# EAGLE design magnet (EAGLE 9.6.2)

## Sheet 1 of 2
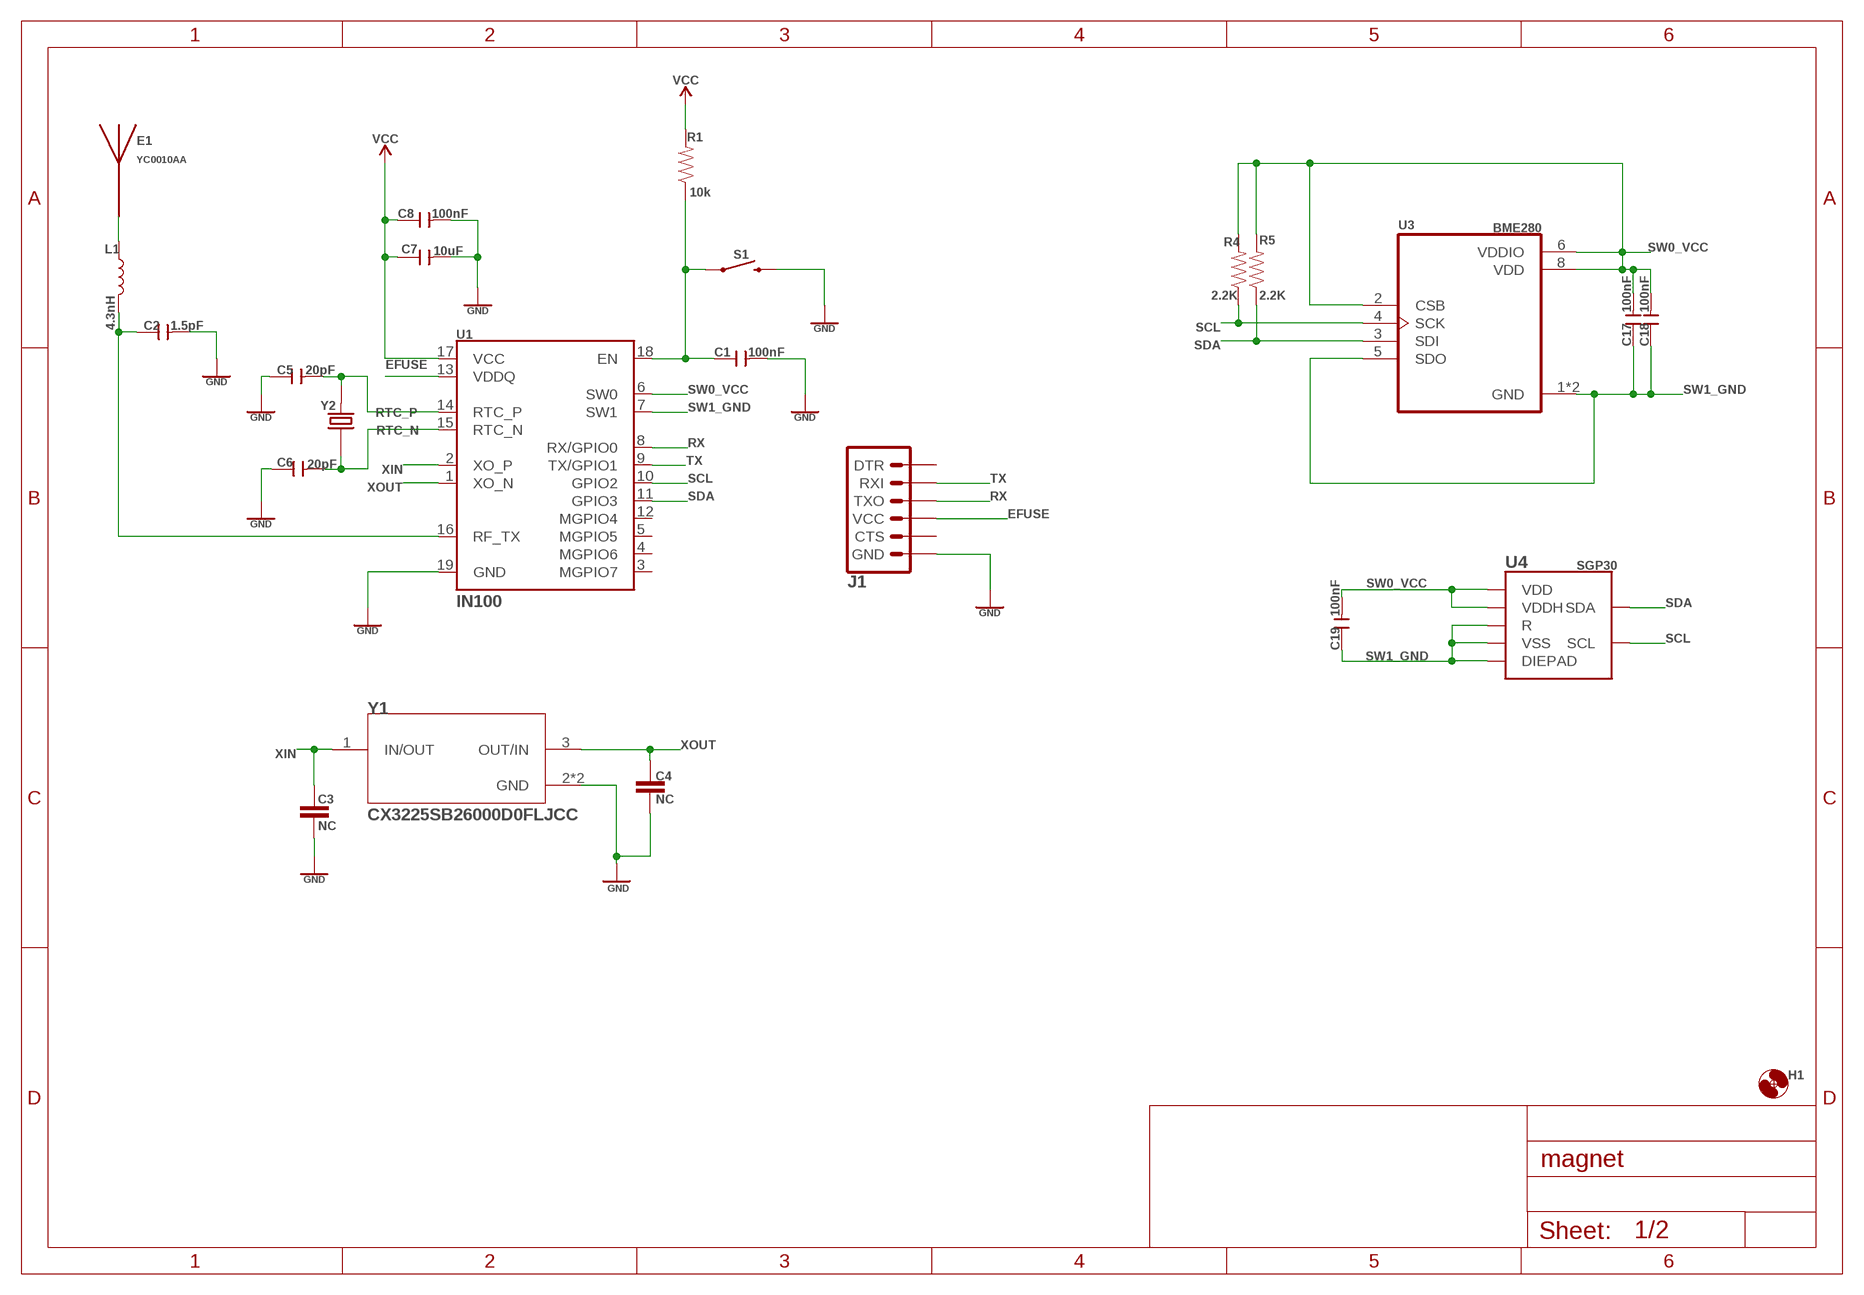
[diagram p0: schematic, sheet 1]

### Parts
C1  100nF  CERAMIC-100NF-50V-10%-X7R(0603)  [C0603]
C2  1.5pF  CERAMIC-10PF-50V-5%-NPO(0603)  [C0603]
C3  NC  12PF-0603-50V-5%  [0603]
C4  NC  12PF-0603-50V-5%  [0603]
C5  20pF  CERAMIC-22PF-50V-5%-NPO(0603)  [C0603]
C6  20pF  CERAMIC-22PF-50V-5%-NPO(0603)  [C0603]
C7  10uF  CERAMIC-10UF-10V-10%-X5R(0603)  [C0603]
C8  100nF  CERAMIC-100NF-50V-10%-X7R(0603)  [C0603]
C17  100nF  CERAMIC-100NF-50V-10%-X7R(0603)  [C0603]
C18  100nF  CERAMIC-100NF-50V-10%-X7R(0603)  [C0603]
C19  100nF  CERAMIC-100NF-50V-10%-X7R(0603)  [C0603]
E1  YC0010AA  [XCVR_YC0010AA]
H1  MOUNT-HOLE3.0  [3,0]
J1  6_PIN_SERIAL_TARGETSMD  [1X06-SMD_RA_MALE]
L1  4.3nH  INDUCTOR-0603-33NH  [0603]
R1  10k  10KOHM-0603-1/10W-1%  [0603]
R4  2.2K  2.2KOHM-0603-1/10W-1%  [0603]
R5  2.2K  2.2KOHM-0603-1/10W-1%  [0603]
S1  MOMENTARY-SWITCH-SPST-SMD-4.6X2.8MM  [TACTILE_SWITCH_SMD_4.6X2.8MM]
U1  IN100  [IN100]
U3  BME280  [PSON65P250X250X100-8N]
U4  SGP30  [SGP30]
Y1  CX3225SB26000D0FLJCC  ECS-480-8-33B-CWY-TR3  [XTAL_ECS-480-8-33B-CWY-TR3]
Y2  ECS-.327-12.5-16-TR  [XTAL_ECS-.327-12.5-16-TR]

### Nets
EFUSE: J1.4(VCC) U1.13(VDDQ)
GND: C1.2 C2.2 C3.2 C4.2 C5.1 C6.1 C7.2 C8.2 J1.6(GND) S1.3 S1.4 U1.19(GND) Y1.2(GND) Y1.4(GND) ; also sheet 2
N$1: C2.1 L1.2 U1.16(RF_TX)
N$2: E1.1 L1.1
N$3: C1.1 R1.1 S1.1 S1.2 U1.18(EN)
RTC_N: C6.2 U1.15(RTC_N) Y2.1
RTC_P: C5.2 U1.14(RTC_P) Y2.2
RX: J1.3(TXO) U1.8(RX/GPIO0)
SCL: R4.1 U1.10(GPIO2) U3.4(SCK) U4.6(SCL)
SDA: R5.1 U1.11(GPIO3) U3.3(SDI) U4.3(SDA)
SW0_VCC: C17.2 C18.2 C19.2 R4.2 R5.2 U1.6(SW0) U3.2(CSB) U3.6(VDDIO) U3.8(VDD) U4.1(VDD) U4.5(VDDH)
SW1_GND: C17.1 C18.1 C19.1 U1.7(SW1) U3.1(GND) U3.5(SDO) U3.7(GND) U4.2(VSS) U4.4(R) U4.DIEPAD
TX: J1.2(RXI) U1.9(TX/GPIO1)
VCC: C7.1 C8.1 R1.2 U1.17(VCC) ; also sheet 2
XIN: C3.1 U1.2(XO_P) Y1.1(IN/OUT)
XOUT: C4.1 U1.1(XO_N) Y1.3(OUT/IN)
Unconnected: J1.1(DTR) J1.5(CTS) U1.3(MGPIO7) U1.4(MGPIO6) U1.5(MGPIO5) U1.12(MGPIO4)

## Sheet 2 of 2
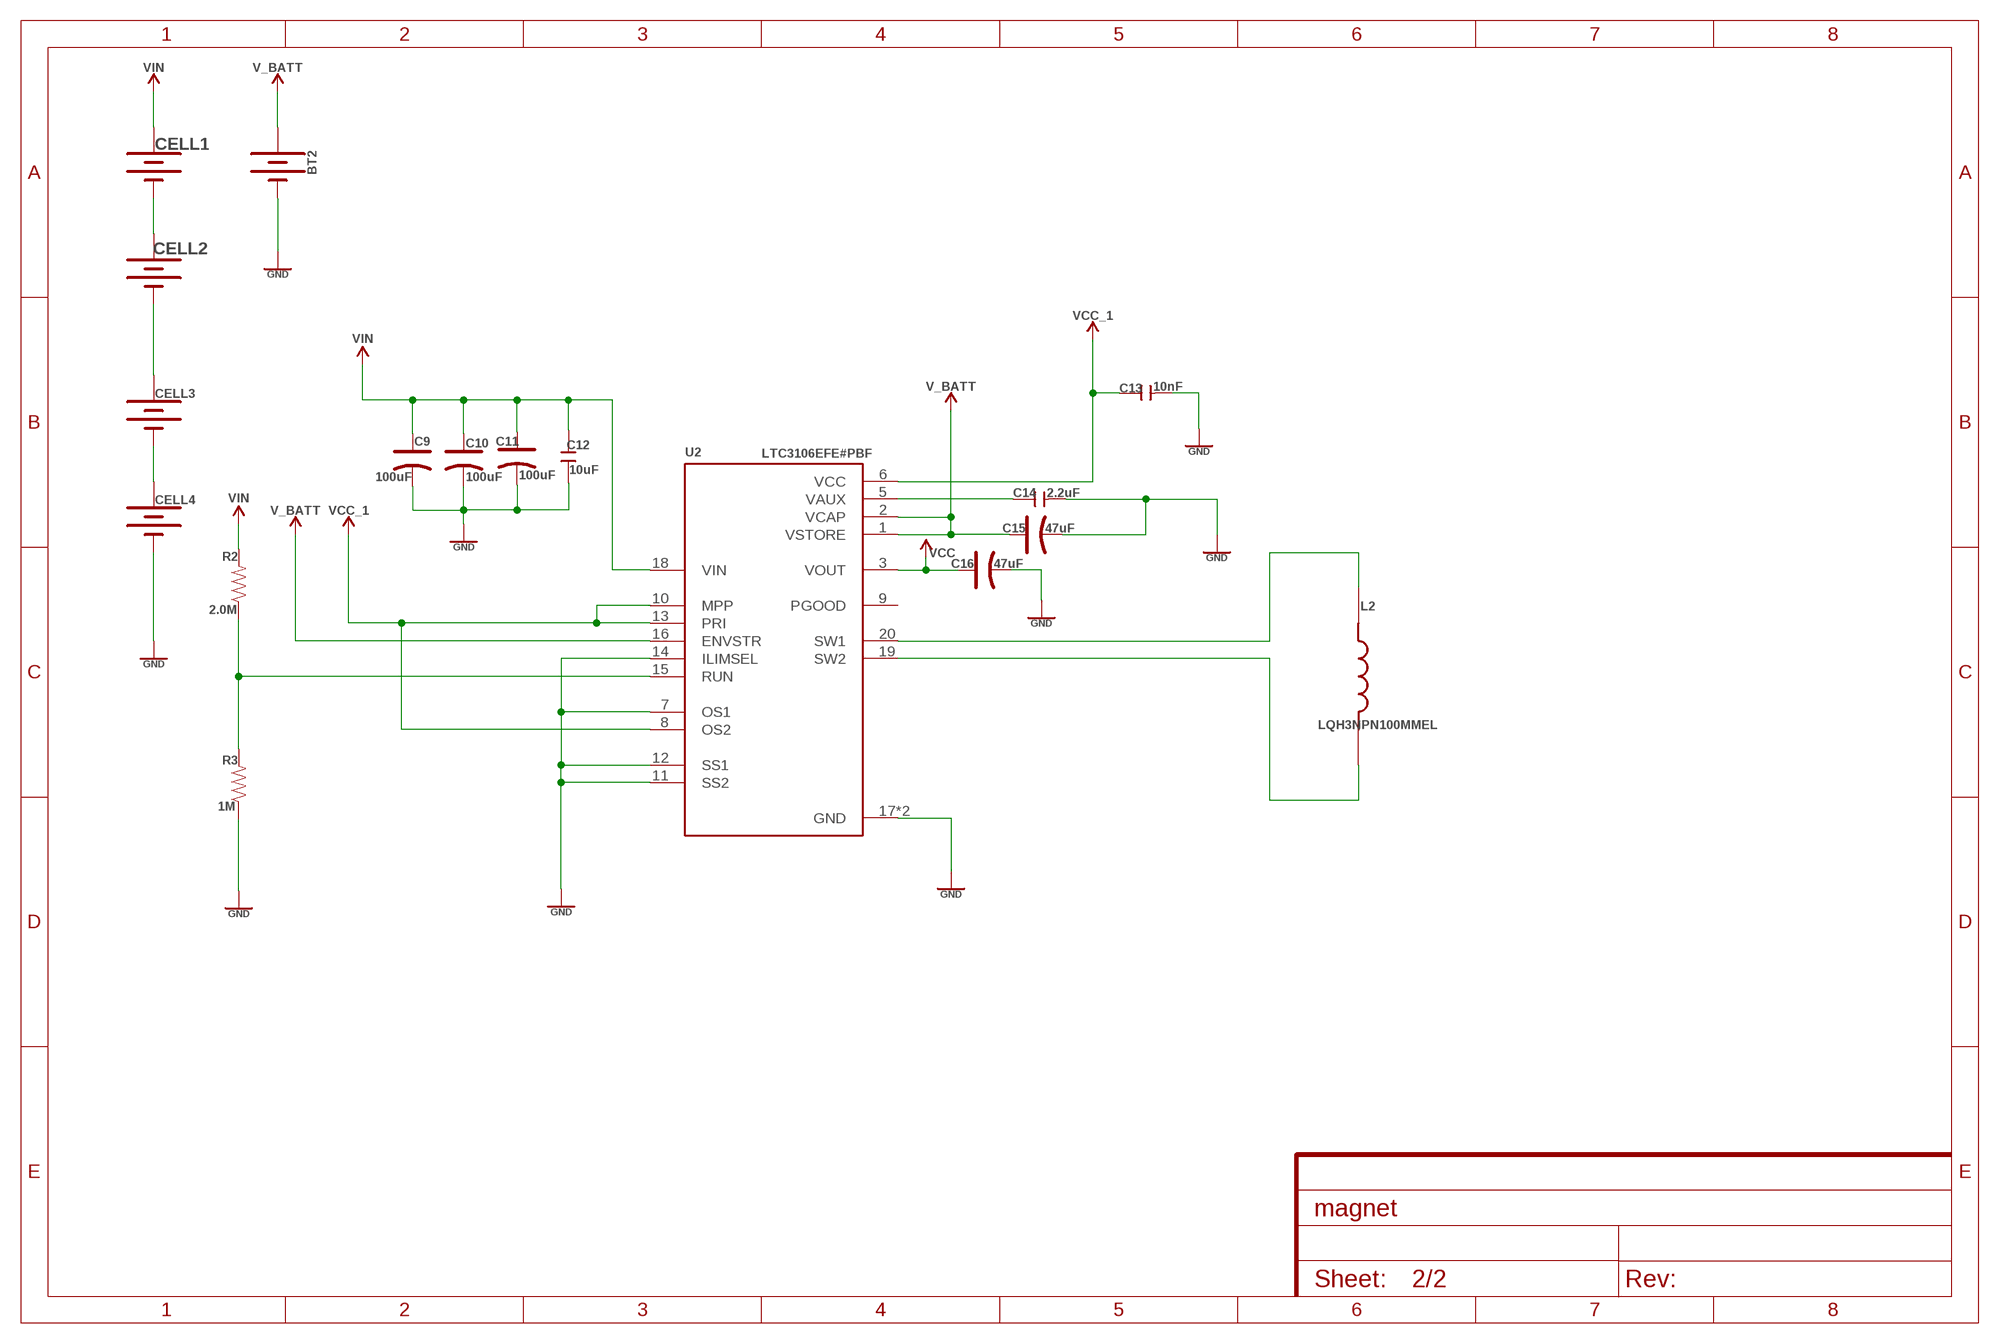
[diagram p1: schematic, sheet 2]

### Parts
BT2  BATTERY-12MM_SMD  [BATTCON_12MM]
C9  100uF  TANTALUM-SMD-47UF-6.3V(AVX-A)  [AVX-A]
C10  100uF  TANTALUM-SMD-47UF-6.3V(AVX-A)  [AVX-A]
C11  100uF  TANTALUM-SMD-47UF-6.3V(AVX-A)  [AVX-A]
C12  10uF  CERAMIC-10UF-6.3V-20%-X5R(0603)  [C0603]
C13  10nF  CERAMIC-10NF-50V-10%-X7R(0603)  [C0603]
C14  2.2uF  CERAMIC-2.2UF-10V-10%-X7R(0603)  [C0603]
C15  47uF  TANTALUM-SMD-47UF-6.3V(AVX-A)  [AVX-A]
C16  47uF  TANTALUM-SMD-47UF-6.3V(AVX-A)  [AVX-A]
CELL1  KXOB25  [KXOB25]
CELL2  KXOB25  [KXOB25]
CELL3  KXOB25  [KXOB25]
CELL4  KXOB25  [KXOB25]
L2  LQH3NPN100MMEL  [IND_LQH3NPN100MMEL]
R2  2.0M  2MOHMS-0603-1/10W-1%  [0603]
R3  1M  1MOHM-0603-1/4W-5%  [0603]
U2  LTC3106EFE#PBF  [SOP65P640X120-21N]

### Nets
GND: BT2.GND(-) C9.- C10.- C11.- C12.1 C13.2 C14.2 C15.- C16.- CELL4.- R3.1 U2.7(OS1) U2.11(SS2) U2.12(SS1) U2.14(ILIMSEL) U2.17(GND) U2.21(GND) ; also sheet 1
N$4: L2.1 U2.20(SW1)
N$5: L2.2 U2.19(SW2)
N$6: CELL1.- CELL2.+
N$7: CELL2.- CELL3.+
N$8: CELL3.- CELL4.+
N$9: C14.1 U2.5(VAUX)
N$10: R2.1 R3.2 U2.15(RUN)
V_BATT: BT2.PWR@1(+) C15.+ U2.1(VSTORE) U2.2(VCAP) U2.16(ENVSTR)
VCC: C16.+ U2.3(VOUT) ; also sheet 1
VCC_1: C13.1 U2.6(VCC) U2.8(OS2) U2.10(MPP) U2.13(PRI)
VIN: C9.+ C10.+ C11.+ C12.2 CELL1.+ R2.2 U2.18(VIN)
Unconnected: U2.9(PGOOD)

## Library data of the parts
BT2 = SparkFun-Batteries:BATTERY: Battery - Single Cell A variety of battery chemistries, sizes, and footprints. Device List: 20MM_PTH - Coin Cell Battery Holder - 20mm (PTH) <https://www.sparkfun.com/products/783> 6.8MM_PTH - Coin Cell Battery Holder - 6.8MM(SMD) <https://www.digikey.com/product-detail/en/seiko-instruments/MS621FE-FL11E/728-1057-ND/1889208?WT.srch=1&gclid=CNOQ5a6LzdQCFZS2wAodXCkE0g> 12MM_SMD - Coin Cell Battery Holder - 12mm (SMD) <https://www.sparkfun.com/products/10592> 12MM_PTH - Coin Cell Battery Holder - 12mm (PTH) <https://www.sparkfun.com/products/7948> 20MM_SMD - 20mm Coin Cell Battery Holder (SMD) (2 legs) Used on the Big Time Watch Kit <https://www.sparkfun.com/products/11734> 20MM_SMD_4LEGS - Coin Cell Battery Holder - 20mm (SMD) <https://www.sparkfun.com/products/11892> 20MM_SMD_4LEGS_OVERPASTE - Coin Cell Battery Holder - 20mm (SMD) <https://www.sparkfun.com/products/11892> (Over-paste on the legs) 24.5MM_PTH - Coin Cell Battery Holder - 24.5mm (PTH) <https://www.sparkfun.com/products/8863> 9V - 9V Battery Holder - PC Mount Used on the SparkFun SparkPunk Sound Kit <https://www.sparkfun.com/products/11177> and SparkFun SparkPunk Sequencer Kit <https://www.sparkfun.com/products/12707> 18650 - Battery Holder - 18650 (PTH) <https://www.sparkfun.com/products/13113> AA - Battery Holder - 1xAA (PTH) <https://www.sparkfun.com/products/7949> AAA - Battery Holder - 1xAAA (PTH) <https://www.sparkfun.com/products/12718> AA_KIT - Battery Holder - 1xAA (PTH) <https://www.sparkfun.com/products/7949> Special kit package - pads only have exposed copper on one side of the board. AAA_KIT - Battery Holder - 1xAAA (PTH) <https://www.sparkfun.com/products/12718> Special kit package - pads only have exposed copper on one side of the board.; PROD_ID: BATT-08044; SF_SKU: PRT-10592
C1 C8 C17-C19 = OPL_Capacitor:CERAMIC-100NF-50V-10%-X7R(0603): 302010138; MPN: CC0603KRX7R9BB104; VALUE: 100nf
C2 = OPL_Capacitor:CERAMIC-10PF-50V-5%-NPO(0603): 302010097; MPN: CC0603JRNPO9BN100; VALUE: 10pf
C3 C4 = SparkFun-Capacitors:12PF: 12pF ceramic capacitors A capacitor is a passive two-terminal electrical component used to store electrical energy temporarily in an electric field.; PROD_ID: CAP-09137; VALUE: 12pF
C5 C6 = OPL_Capacitor:CERAMIC-22PF-50V-5%-NPO(0603): 302010143; MPN: CC0603JRNPO9BN220; VALUE: 22pf
C7 = OPL_Capacitor:CERAMIC-10UF-10V-10%-X5R(0603): 302010103; MPN: CC0603KRX5R6BB106; VALUE: 10uf
C9-C11 C15 C16 = OPL_Capacitor:TANTALUM-SMD-47UF-6.3V(AVX-A): 302020005; MPN: TAJA476*006#NJ; VALUE: 47uf
C12 = OPL_Capacitor:CERAMIC-10UF-6.3V-20%-X5R(0603): 302010286; MPN: CC0603MRX5R5BB106; VALUE: 10UF 6.3V
C13 = OPL_Capacitor:CERAMIC-10NF-50V-10%-X7R(0603): 302010140; MPN: CC0603KRX7R9BB103; VALUE: 10nf
C14 = OPL_Capacitor:CERAMIC-2.2UF-10V-10%-X7R(0603): 302010054; MPN: CC0603KRX7R6BB225; VALUE: 2.2uf
CELL1-CELL4 = KXOB25:KXOB25
E1 = YC0010AA:YC0010AA: 2400 ~ 2500MHz, Wi-Fi（BT）, 5.2*2.0*1.2mm,ceramic SMD Antenna Check availability <https://pricing.snapeda.com/parts/YC0010AA/Quectel/view-part?ref=eda>; AVAILABILITY: In Stock; DESCRIPTION: 2400 ~ 2500MHz, Wi-Fi（BT）, 5.2*2.0*1.2mm,ceramic SMD Antenna; MF: Quectel; MP: YC0010AA; PACKAGE: None; PRICE: None; PURCHASE-URL: https://pricing.snapeda.com/search/part/YC0010AA/?ref=eda
H1 = holes:MOUNT-HOLE: MOUNTING HOLE with drill center marker
J1 = SparkFun-Connectors:6_PIN_SERIAL_TARGET: 6-pin header connection for use with the "FTDI BASIC" pinout - TARGET SIDE. Also known as "Arduino Serial Program Header". It is used to mate with our FTDI Basic serial programmers using the Arduino IDE. Note, this device has "TARGET" in the name. It is intended to be used on a design that contains a target micro-controller that you wish to program. The "sister" device, named "CABLE" is inteneded to be used on a design that usually lives on the end of your USB cable and prvides the converter chip (FTDI232 or FTDI231x) to commnicate serial RX/TX. You can populate with some of these: Break Away Headers - Straight <https://www.sparkfun.com/products/116> (PRT-00116) For reference (or to suit your programming needs) check out these designs: SparkFun FTDI Basic Breakout - 5V <https://www.sparkfun.com/products/9716> (DEV-09716) SparkFun FTDI Basic Breakout - 3.3V <https://www.sparkfun.com/products/9873> (DEV-09873) SparkFun FTDI SmartBasic <https://www.sparkfun.com/products/12935> (DEV-12935) SparkFun Beefy 3 - FTDI Basic Breakout <https://www.sparkfun.com/products/13746> (DEV-13746); PROD_ID: CONN-08971
L1 = SparkFun-Coils:INDUCTOR: Inductors Resist changes in electrical current. Basically a coil of wire. SparkFun Products: SparkFun Load Cell Amplifier - HX711 <https://www.sparkfun.com/products/13879> IOIO-OTG - V2.2 <https://www.sparkfun.com/products/13613>; PROD_ID: NDUC-07874; VALUE: 33nH/±5%/500mA
L2 = LQH3NPN100MMEL:LQH3NPN100MMEL: Fixed Inductors; DESCRIPTION: 10µH Shielded Wirewound Inductor 800mA 228mOhm Max 1212 (3030 Metric); DIGI-KEY_PART_NUMBER: 490-15945-1-ND; DIGIKEY-PURCHASE-URL: https://snapeda.com/shop?store=DigiKey&id=4547508; MF: Murata; MOUSER-PURCHASE-URL: https://snapeda.com/shop?store=Mouser&id=4547508; MP: LQH3NPN100MMEL; PACKAGE: 1212 Murata
R1 = SparkFun-Resistors:10KOHM: 10kΩ resistor A resistor is a passive two-terminal electrical component that implements electrical resistance as a circuit element. Resistors act to reduce current flow, and, at the same time, act to lower voltage levels within circuits. - Wikipedia; PROD_ID: RES-00824
R2 = SparkFun-Resistors:2MOHMS: 2MΩ resistor A resistor is a passive two-terminal electrical component that implements electrical resistance as a circuit element. Resistors act to reduce current flow, and, at the same time, act to lower voltage levels within circuits. - Wikipedia; PROD_ID: RES-10054
R3 = SparkFun-Resistors:1MOHM: 1MΩ resistor A resistor is a passive two-terminal electrical component that implements electrical resistance as a circuit element. Resistors act to reduce current flow, and, at the same time, act to lower voltage levels within circuits. - Wikipedia; PROD_ID: RES-07868
R4 R5 = SparkFun-Resistors:2.2KOHM: 2.2kΩ resistor A resistor is a passive two-terminal electrical component that implements electrical resistance as a circuit element. Resistors act to reduce current flow, and, at the same time, act to lower voltage levels within circuits. - Wikipedia; PROD_ID: RES-08272; VALUE: 2.2k
S1 = SparkFun-Switches:MOMENTARY-SWITCH-SPST: Momentary Switch (Pushbutton) - SPST Normally-open (NO) SPST momentary switches (buttons, pushbuttons). Variants PTH-12MM - 12mm square, through-hole Momentary Pushbutton Switch - 12mm Square <https://www.sparkfun.com/products/9190> (COM-09190) PTH-6.0MM, PTH-6.0MM-KIT - 6.0mm square, through-hole Mini Pushbutton Switch <https://www.sparkfun.com/products/97> (COM-00097) KIT package intended for soldering kit's - only one side of pads' copper is exposed. PTH-RIGHT-ANGLE-KIT - Right-angle, through-hole Right Angle Tactile Button <https://www.sparkfun.com/products/10791> - Used on SparkFun BigTime Watch Kit <https://www.sparkfun.com/products/11734> SMD-12MM - 12mm square, surface-mount Tactile Button - SMD (12mm) <https://www.sparkfun.com/products/12993> (COM-12993) Used on SparkFun PicoBoard <https://www.sparkfun.com/products/11888> SMD-4.5MM - 4.5mm Square Trackball Switch Used on SparkFun Blackberry Trackballer Breakout <https://www.sparkfun.com/products/13169> SMD-4.6MMX2.8MM - 4.60mm x 2.80mm, surface mount Used on SparkFun SAMD21 Mini Breakout <https://www.sparkfun.com/products/13664> SMD-5.2MM, SMD-5.2-REDUNDANT - 5.2mm square, surface-mount Mini Pushbutton Switch - SMD <https://www.sparkfun.com/products/8720> (COM-08720) Used on Arduino Pro Mini <https://www.sparkfun.com/products/11114> REDUNDANT package connects both switch circuits together SMD-6.0X3.5MM - 6.0 x 3.5mm, surface mount Momentary Reset Switch SMD <https://www.sparkfun.com/products/8229> (COM-08229) SMD-6.2MM-TALL - 6.2mm square, surface mount Tactile Button - SMD (6mm) <https://www.sparkfun.com/products/12992> Used on SparkFun Digital Sandbox <https://www.sparkfun.com/products/12651> SMD-RIGHT-ANGLE - Right-angle, surface mount Used on SparkFun Block for Intel® Edison - Arduino <https://www.sparkfun.com/products/13036>; PROD_ID: SWCH-13065
U1 = IN100:IN100; PROD_ID: IC-17260
U2 = LTC3106EFE_PBF:LTC3106EFE#PBF: LTC3106 - 300mA Low Voltage Buck-Boost Converter with PowerPath and 1.6μA Quiescent Current; DESCRIPTION: Conv DC-DC -0.3V to 6V Non-Inv/Inv/Step Up/Step Down Single-Out 1.8V/2.2V/3.3V/5V 0.3A 20-Pin TSSOP; MF: Analog Devices; MOUSER-PURCHASE-URL: https://snapeda.com/shop?store=Mouser&id=4332360; MP: LTC3106EFE#PBF; PACKAGE: TSSOP W/ EP-20 Analog Devices
U3 = BME280:BME280: DIGITAL HUMIDITY, PRESSURE AND TEMPERATURE SENSOR * Digital interface I²C (up to 3.4 MHz) and SPI (3 and 4 wire, up to 10 MHz)* Supply voltage VDD main supply voltage range: 1.71 V to 3.6 V*VDDIO interface voltage range: 1.2 V to 3.6 V Operating range -40…+85 °C, 0…100 % rel. humidity, 300…1100 hPa The library has been designed by Richard Magdycz <https://www.facebook.com/groups/eaglecadsoftUK> Check availability <https://pricing.snapeda.com/parts/BME280/Bosch/view-part?ref=eda>; AVAILABILITY: In Stock; DESCRIPTION: Board Mount Humidity Sensors MEMS humidity, pressure and temperature sensor; MF: Bosch; MP: BME280; PACKAGE: LGA-8 Bosch; PRICE: None; PURCHASE-URL: https://pricing.snapeda.com/search/part/BME280/?ref=eda
U4 = SGP30:SGP30: The SGP30 is a digital multi-pixel gas sensor designed for easy integration into air purifier, demand-controlled ventilation, and IoT applications. Check availability <https://pricing.snapeda.com/parts/SGP30/Sensirion%20AG/view-part?ref=eda>; AVAILABILITY: In Stock; DESCRIPTION: SGP30, SHTC1 Air Quality, Humidity, Temperature Sensor Arduino Platform Evaluation Expansion Board; MF: Sensirion AG; MP: SGP30; PACKAGE: None; PRICE: None
Y1 = CX3225SB26000D0FLJCC:ECS-480-8-33B-CWY-TR3: Check availability <https://pricing.snapeda.com/parts/ECS-480-8-33B-CWY-TR3/ECS%20Inc./view-part?ref=eda>; AVAILABILITY: In Stock; DESCRIPTION: Crystal - 48MHz ±10ppm - 10 pF - ±15 ppm - -30 to +85°C 3225 Low aging; MF: Kyocera; MP: CX3225SB26000D0FLJCC; PACKAGE: None; PRICE: None; PURCHASE-URL: https://pricing.snapeda.com/search/part/ECS-480-8-33B-CWY-TR3/?ref=eda
Y2 = ECS-.327-12.5-16-TR:ECS-.327-12.5-16-TR: SMD Tuning Fork Crystal Check availability <https://pricing.snapeda.com/parts/ECS-.327-12.5-16-TR/ECS%20Inc./view-part?ref=eda>; AVAILABILITY: In Stock; DESCRIPTION: 32.768 kHz ±20ppm Crystal 12.5pF 90 kOhms 2-SMD, No Lead; MF: ECS Inc.; MP: ECS-.327-12.5-16-TR; PACKAGE: SMD-2 ECS International; PRICE: None; PURCHASE-URL: https://pricing.snapeda.com/search/part/ECS-.327-12.5-16-TR/?ref=eda

## Board
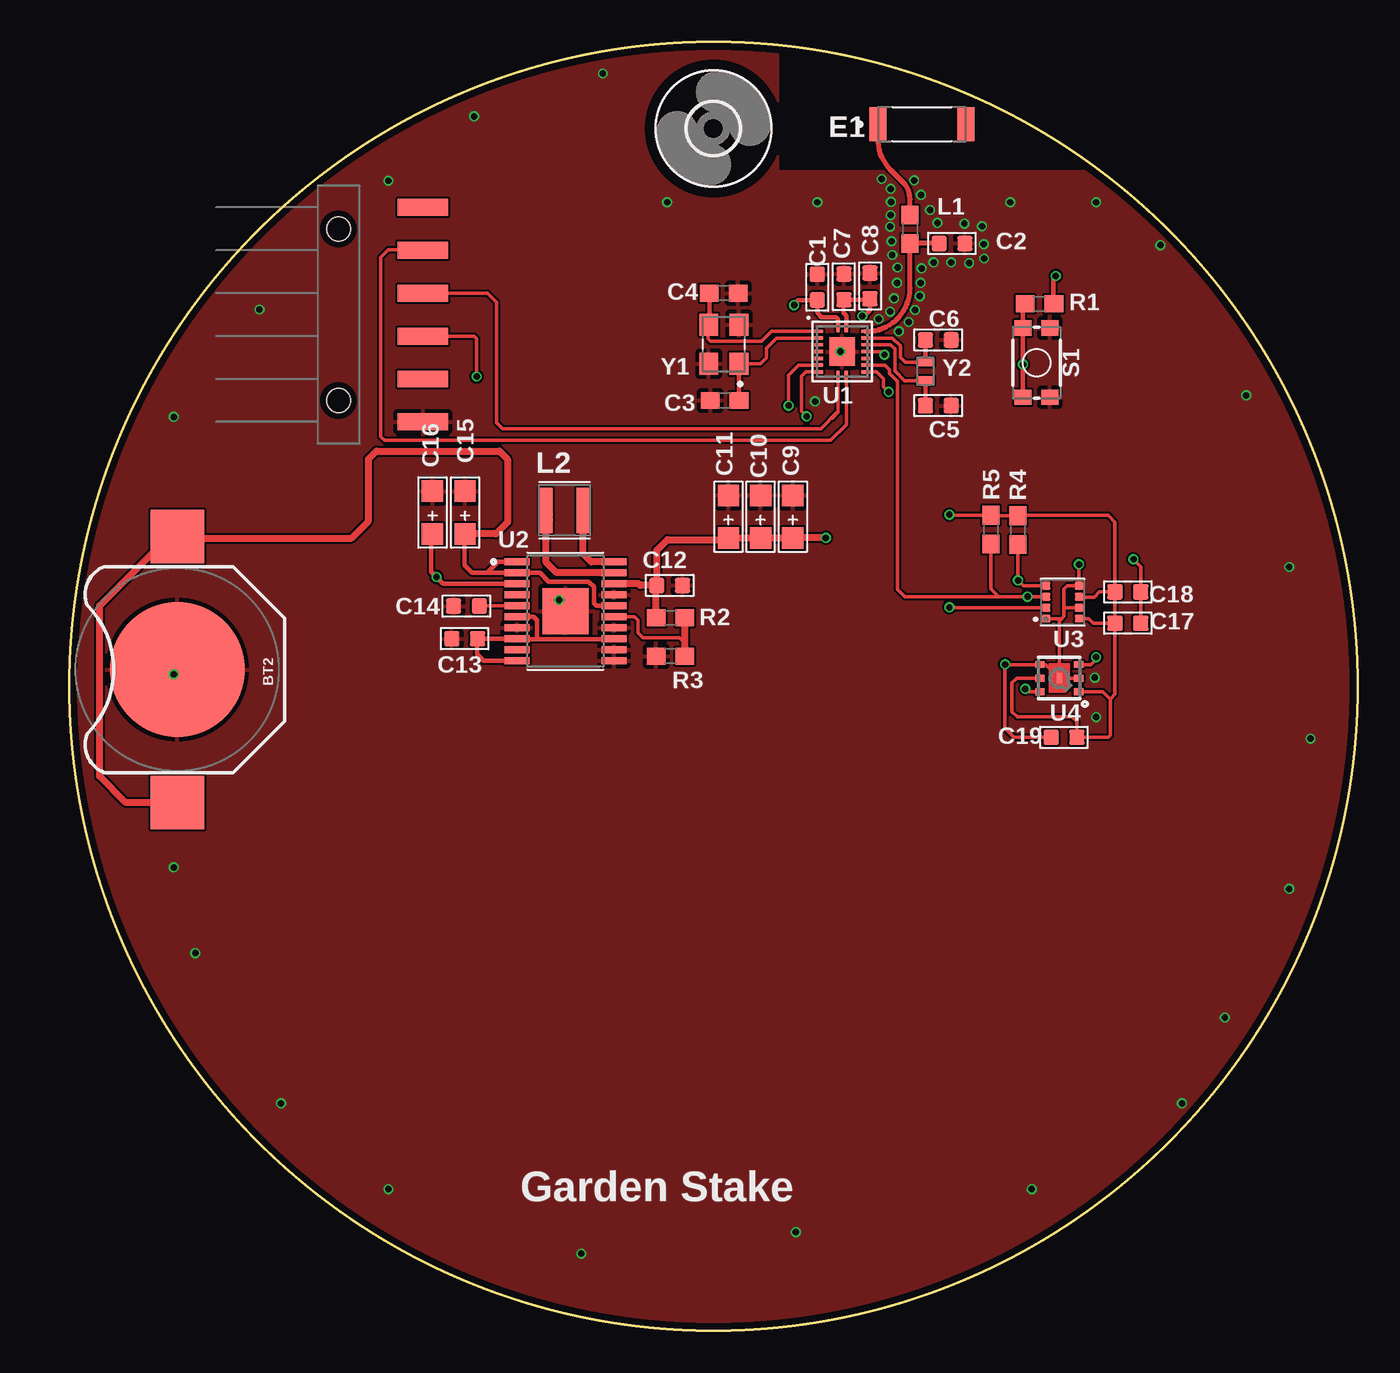
[diagram p2: board, top side]
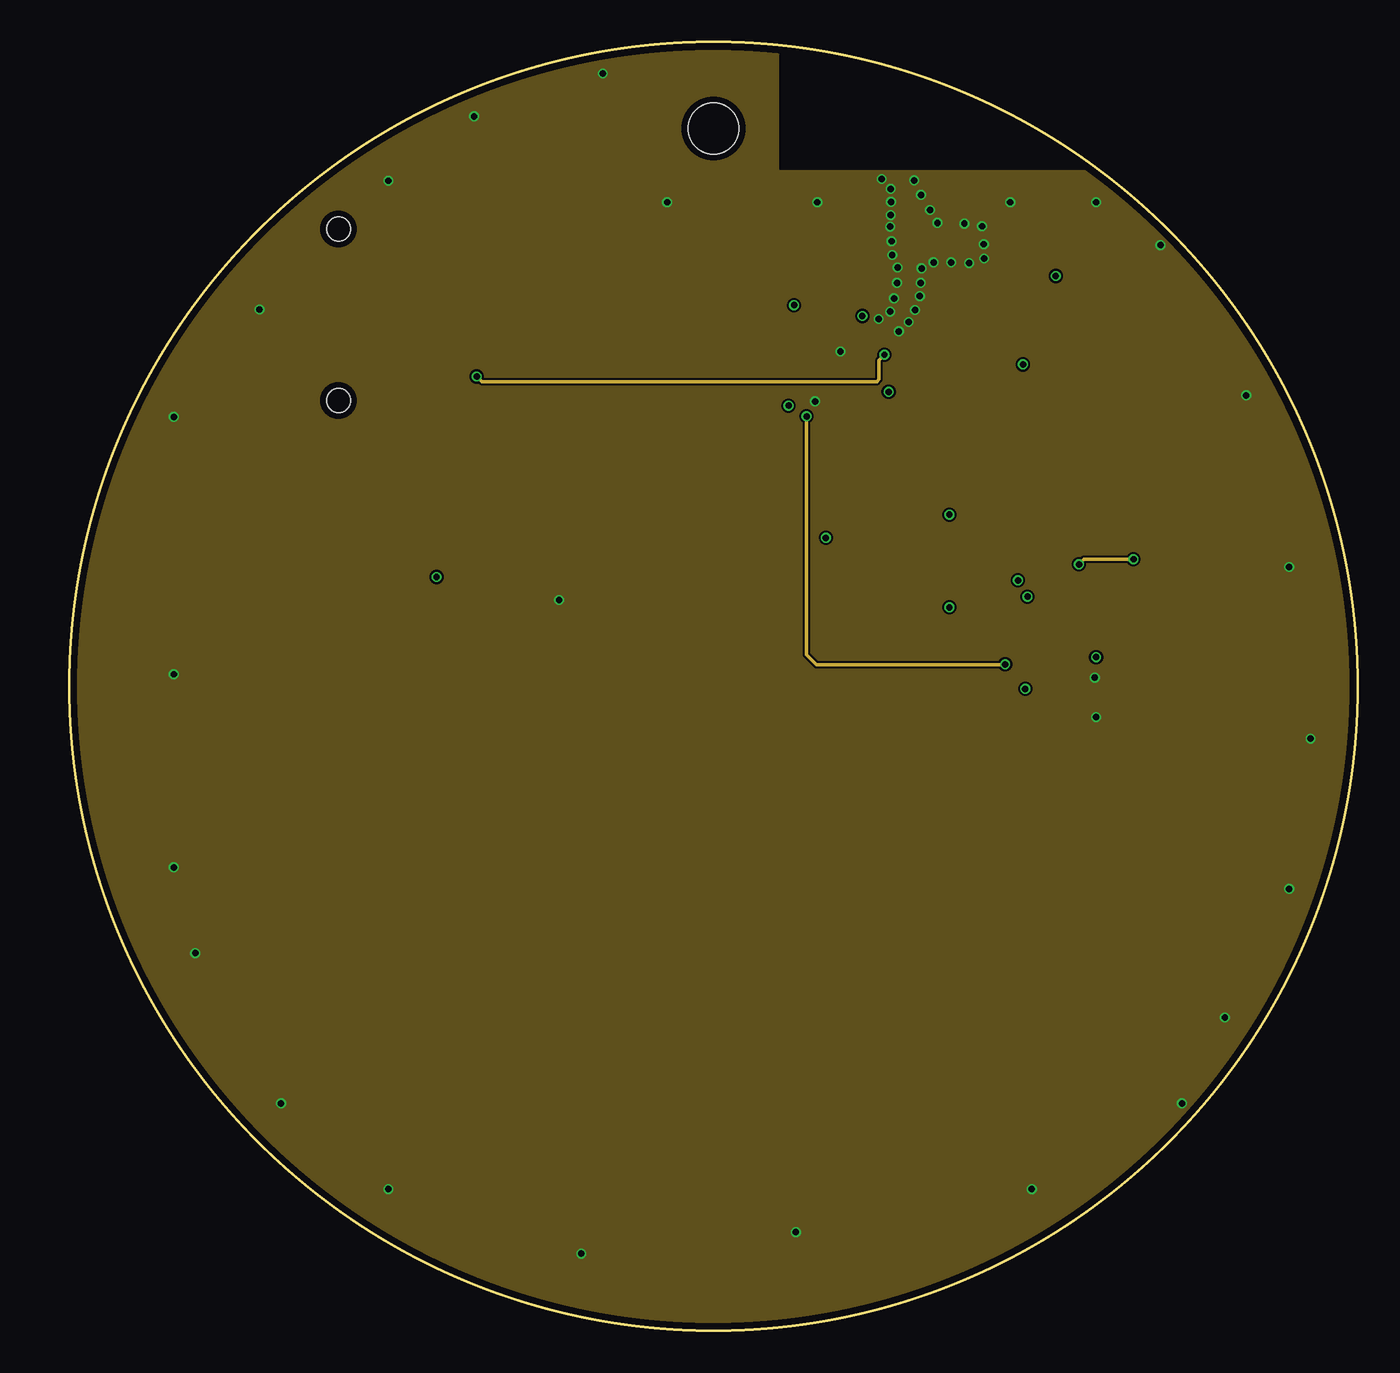
[diagram p3: board, inner layer Route2]
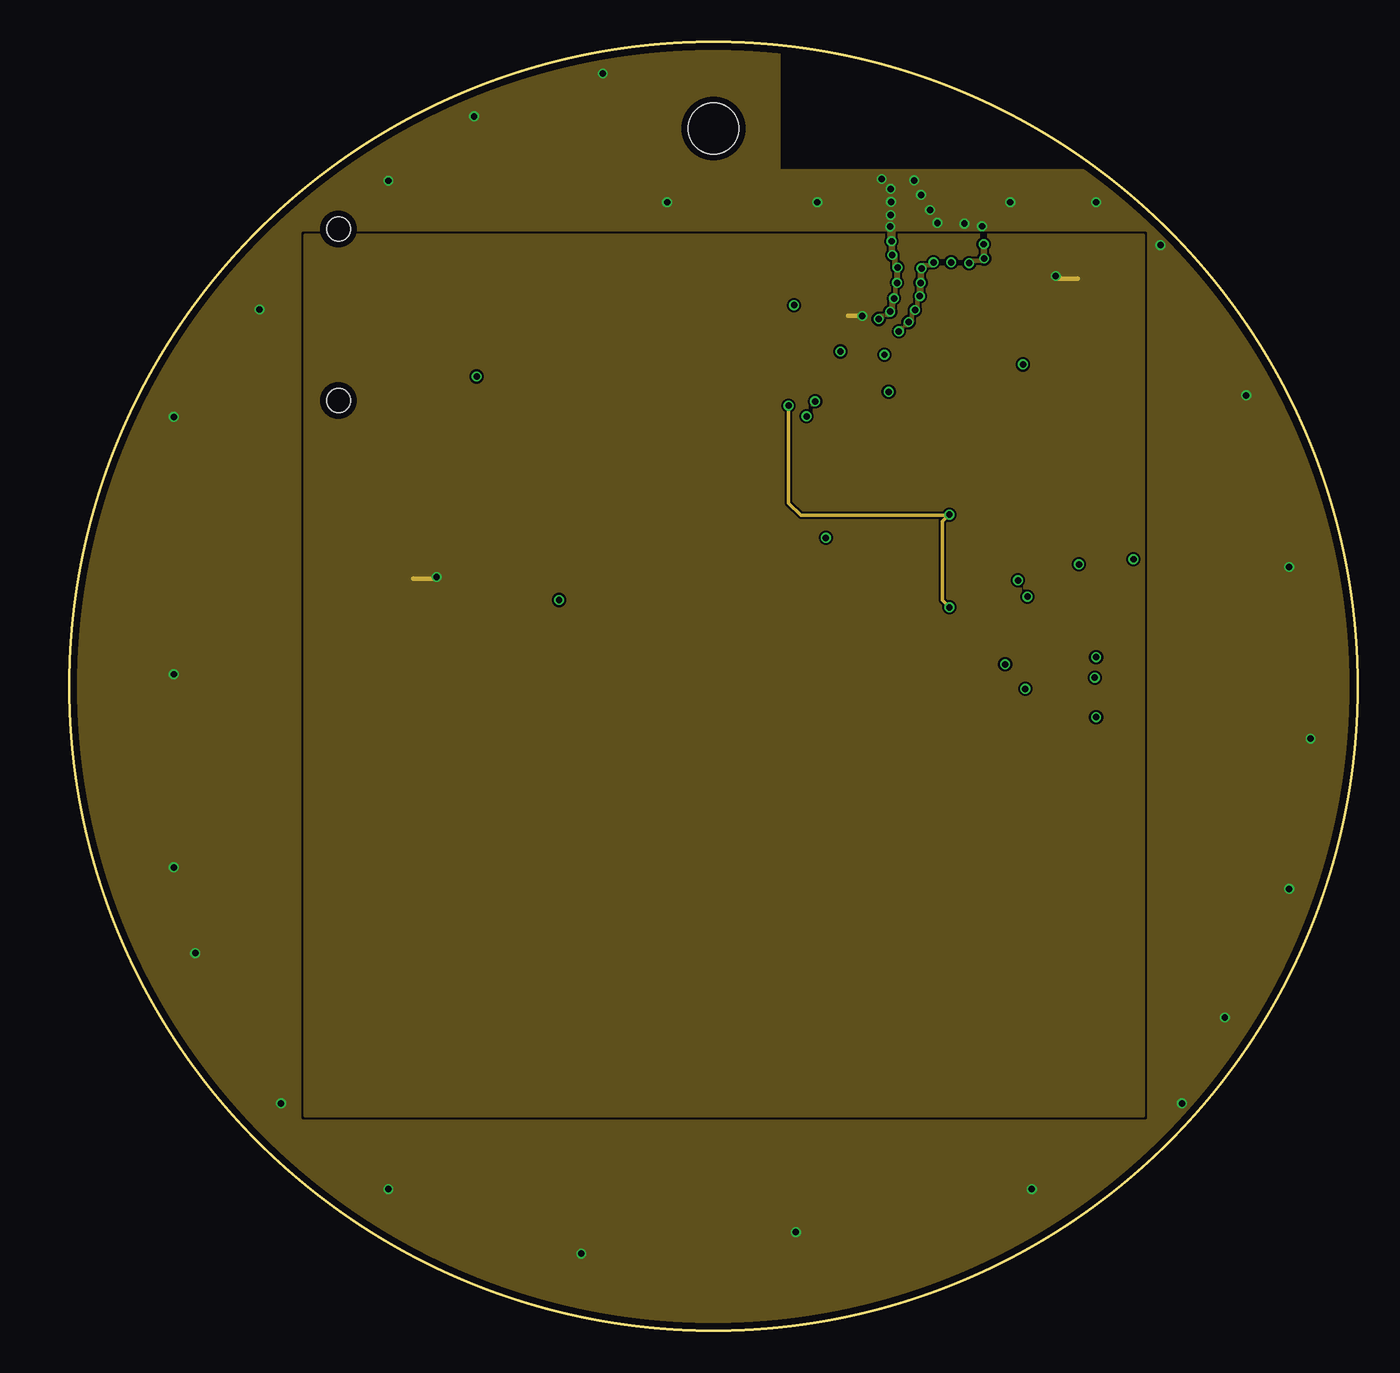
[diagram p4: board, inner layer Route15]
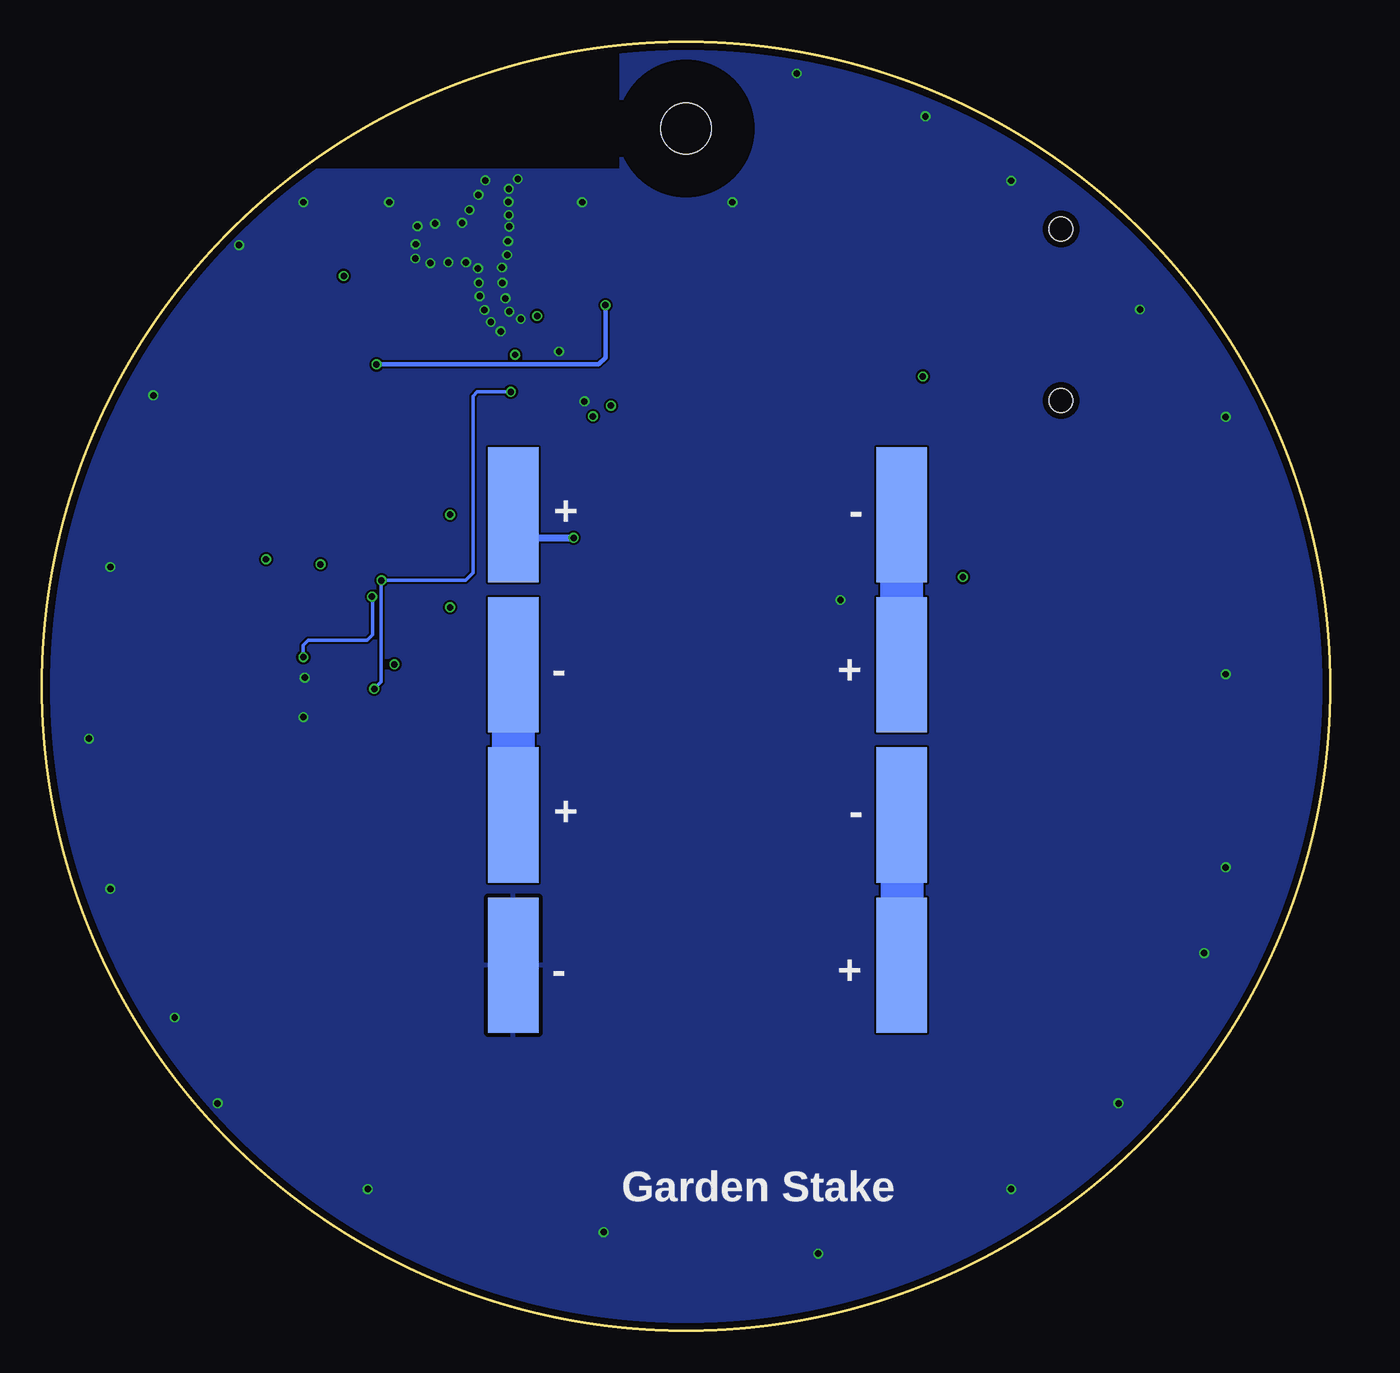
[diagram p5: board, bottom side, seen from below]

Size 76.24 x 76.24 mm. Coordinates in mm from the lower left corner, seen from the top.
Outline: circle at 38.12,38.12 radius 38.12
Copper layers (1*2*15*16): Top 0.035559375mm / dielectric 0.17018125mm / Route2 0.01778125mm / dielectric 47mil / Route15 0.01778125mm / dielectric 0.17018125mm / Bottom 0.035559375mm
Design rules "oshpark-4layer": minimum track width 5mil, minimum drill 10mil, track to track 5mil, track to pad 5mil, pad to pad 5mil, via to via 5mil, smd to smd 5mil, copper to edge 15mil, drill to drill 6mil, minimum pad ring 4mil, minimum via ring 4mil, stop-mask expansion 1.5mil, vias tented up to drill 0mil, thermal gap 10mil

### Footprints (pad centres in the part's own frame; a part is rotated, then mirrored left to right if it is on the bottom)
BATTCON_12MM = smd 8 x 8: GND 0,0 | smd 3.175 x 3.175: PWR@1 -7.874,0; PWR@2 7.874,0
C0603 = smd 0.889 x 0.889: 1 0,0.762; 2 0,-0.762
0603 = smd 1.1 x 1: 1 -0.85,0; 2 0.85,0
AVX-A = smd 1.27 x 1.27: + -1.27,0; - 1.27,0
KXOB25 = smd 3 x 8: + -11.5,0; - 11.5,0
XCVR_YC0010AA = smd 1 x 2: 1 -2.6,0; 2 2.6,0
3,0 = hole 3: 0,0
1X06-SMD_RA_MALE = smd 1 x 3: 1 -6.35,5; 2 -3.81,5; 3 -1.27,5; 4 1.27,5; 5 3.81,5; 6 6.35,5 | hole 1.4: -5.08,0; 5.08,0
IND_LQH3NPN100MMEL = smd 0.8 x 2.7: 1 -1.1,0; 2 1.1,0
TACTILE_SWITCH_SMD_4.6X2.8MM = smd 0.9 x 1: 1 -2.05,-0.8; 2 2.05,-0.8; 3 2.05,0.8; 4 -2.05,0.8
IN100 = smd 0.5 x 0.2: 1 -1.4,1.2; 2 -1.4,0.8; 3 -1.4,0.4; 4 -1.4,0; 5 -1.4,-0.4; 6 -1.4,-0.8; 7 -1.4,-1.2; 10 1.4,-1.2; 11 1.4,-0.8; 12 1.4,-0.4; 13 1.4,0; 14 1.4,0.4; 15 1.4,0.8; 16 1.4,1.2 | smd 0.2 x 0.5: 8 -0.25,-1.4; 9 0.25,-1.4; 17 0.25,1.4; 18 -0.25,1.4 | smd 1.5 x 1.7: 19 0,0
SOP65P640X120-21N = smd 1.48 x 0.41: 1 -2.865,2.925; 2 -2.865,2.275; 3 -2.865,1.625; 4 -2.865,0.975; 5 -2.865,0.325; 6 -2.865,-0.325; 7 -2.865,-0.975; 8 -2.865,-1.625; 9 -2.865,-2.275; 10 -2.865,-2.925; 11 2.865,-2.925; 12 2.865,-2.275; 13 2.865,-1.625; 14 2.865,-0.975; 15 2.865,-0.325; 16 2.865,0.325; 17 2.865,0.975; 18 2.865,1.625; 19 2.865,2.275; 20 2.865,2.925 | smd 2.74 x 2.74: 21 0,0
PSON65P250X250X100-8N = smd 0.49 x 0.45: 1 0.97,0.975; 2 0.97,0.325; 3 0.97,-0.325; 4 0.97,-0.975; 5 -0.97,-0.975; 6 -0.97,-0.325; 7 -0.97,0.325; 8 -0.97,0.975
SGP30 = smd 0.55 x 0.4: 1 -1.15,0.8; 2 -1.15,0; 3 -1.15,-0.8; 4 1.15,-0.8; 5 1.15,0; 6 1.15,0.8 | smd 0.305 x 0.61: DIEPAD 0,0
XTAL_ECS-480-8-33B-CWY-TR3 = smd 1.3 x 1.1: 1 -1.15,-0.9; 2 1.15,-0.9; 3 1.15,0.9; 4 -1.15,0.9
XTAL_ECS-.327-12.5-16-TR = smd 0.5 x 1: 1 -0.55,0; 2 0.55,0

### Placement (x,y rotation side)
BT2  6.37,39.11 90 top
C1  44.27,61.74 180 top
C2  52.24,64.33 90 top
C3  38.78,55.04 180 top
C4  38.73,61.39 0 top
C5  51.43,54.73 270 top
C6  51.43,58.62 270 top
C7  45.84,61.77 180 top
C8  47.39,61.82 180 top
C9  42.82,48.15 90 top
C10  40.92,48.15 90 top
C11  39.01,48.15 90 top
C12  35.53,44.09 270 top
C13  23.39,40.94 270 top
C14  23.49,42.87 270 top
C15  23.41,48.41 90 top
C16  21.48,48.41 90 top
C17  62.66,41.85 270 top
C18  62.66,43.71 270 top
C19  58.87,35.1 90 top
CELL1  36.85,48.28 0 bottom
CELL2  36.85,39.39 180 bottom
CELL3  36.85,30.5 0 bottom
CELL4  36.85,21.61 180 bottom
E1  50.47,71.4 0 top
H1  38.12,71.14 0 top
J1  15.92,60.12 270 top
L1  49.75,65.17 270 top
L2  29.31,48.54 180 top
R1  57.43,60.75 0 top
R2  35.58,42.19 180 top
R3  35.58,39.9 0 top
R4  56.16,47.37 90 top
R5  54.55,47.39 90 top
S1  57.25,57.27 270 top
U1  45.74,57.93 0 top
U2  29.36,42.57 0 top
U3  58.8,43.1 180 top
U4  58.59,38.6 180 top
Y1  38.73,58.36 90 top
Y2  50.67,56.76 270 top

### Tracks (layer width: path | path; a pad name or v marks a point on that pad's centre or on a via)
EFUSE  (via drill 0.38)
  Top 0.203: U1.13 48.03,57.93 v48.23,57.73 v48.24,57.74 | J1.4 23.95,58.85 24.1,58.7 v24.1,56.46
  Route2 0.203: v48.24,57.74 47.93,57.43 47.93,56.28 47.8,56.16 24.41,56.16 v24.1,56.46
GND  (via drill 0.38)
  other vias: 45.64,57.93 28.98,43.23 48.08,68.14 48.61,67.56 48.64,66.8 48.61,66.01 48.59,65.32 48.66,64.46 48.71,63.65 49.02,62.91 48.99,62 48.81,61.08 48.59,60.3 47.9,59.86 49.09,59.13 49.68,59.69 50.06,60.4 50.34,61.21 50.39,62 50.44,62.86 51.15,63.22 52.19,63.22 53.26,63.17 54.15,63.44 54.12,64.28 54.02,65.35 52.98,65.5 51.38,65.55 50.95,66.32 50.41,67.2 50.01,68.07 60.78,36.29 60.7,38.63 44.14,54.99 65.86,13.43 68.4,18.51 72.21,26.13 73.48,35.02 72.21,45.18 69.67,55.34 64.59,64.23 60.78,66.77 55.7,66.77 44.27,66.77 35.38,66.77 31.57,74.39 23.95,71.85 18.87,68.04 11.25,60.42 6.17,54.07 6.17,27.4 7.44,22.32 12.52,13.43 18.87,8.35 30.3,4.54 43,5.81 56.97,8.35 6.17,38.83
  pour Top: 0.02,15.26 0.02,59.71 19.07,78.76 39.39,78.76 41.93,76.22 41.93,68.6 67.33,68.6 77.49,58.44 77.49,16.53 58.44,-2.52 6.37,-2.52 -1.25,5.1
  pour Route2: -5.06,7.64 -5.06,68.6 15.26,88.92 29.23,88.92 41.93,76.22 41.93,68.6 68.6,68.6 83.84,53.36 86.38,53.36 86.38,10.18 68.6,-7.6 2.56,-7.6 -5.06,0.02
  pour Route15 (rank 3): -17.76,0.02 -17.76,78.76 39.39,78.76 41.93,78.76 41.93,68.6 88.92,68.6 88.92,64.79 88.92,-16.49 83.84,-16.49 -17.76,-16.49 -17.76,-6.33
  pour Bottom: -20.3,-16.49 -20.3,78.76 -10.14,78.76 41.93,78.76 41.93,68.6 88.92,68.6 88.92,-16.49
N$1
  Top 0.305: C2.1 50.25,64.33 arc45 49.75,64.13 L1.2 49.75,61.67 arc-90 47.21,59.13 U1.16
N$2
  Top 0.305: L1.1 49.75,66.95 arc45 49.32,67.99 48.61,68.7 arc-45 47.87,70.5 E1.1
N$3  (via drill 0.38)
  Top 0.254: S1.2 v56.45,57.17 S1.1 56.45,60.63 R1.1 | U1.18 45.49,59.86 45.39,59.97 44.52,59.97 44.27,60.22 C1.1 43.13,60.98 42.9,60.75 v42.9,60.68
  Bottom 0.254: v56.45,57.17 43.3,57.17 42.9,57.58 v42.9,60.68
N$4
  Top 0.406: U2.20 30.88,45.49 30.4,45.97 30.4,48.53 L2.1
N$5
  Top 0.406: U2.19 28.84,44.84 28.22,45.46 28.22,47.75 28.42,47.95 28.42,48.32 L2.2
N$6
  Bottom 2.54: CELL2.+ CELL1.-
N$7
  Bottom 2.54: CELL2.- CELL3.+ 48.35,29.4 arc-45 48.28,29.23
N$8
  Bottom 2.54: CELL3.- CELL4.+
N$9
  Top 0.203: U2.5 24.27,42.89 C14.1
N$10
  Top 0.203: 36.43,40.66 36.1,40.99 33.96,40.99 33.65,41.3 33.65,42.03 33.44,42.24 U2.15
  Top 0.406: R3.2 36.43,40.66 R2.1
RTC_N
  Top 0.152: 47.15,58.72 U1.15
  Top 0.203: Y2.1 49.48,57.32 49.2,57.6 49.2,58.26 48.73,58.73 U1.15
  Top 0.254: Y2.1 C6.2
RTC_P
  Top 0.203: Y2.2 49.44,56.22 48.87,56.79 48.87,58.09 48.61,58.34 U1.14
  Top 0.254: C5.2 Y2.2
RX
  Top 0.203: U1.8 45.49,54.33 | 45.16,54 45.49,54.33 | 45.49,54.33 45.44,54.33 44.47,53.36 25.62,53.36 25.27,53.72 25.27,60.85 24.74,61.39 J1.3
SCL  (via drill 0.38)
  Top 0.203: U3.4 56.48,44.07 v56.16,44.4 R4.1 | U4.6 56.75,37.8 v56.59,37.97 | v48.5,55.55 48.18,55.86 48.18,56.33 47.77,56.74 U1.10
  Bottom 0.203: v56.59,37.97 56.18,38.38 56.18,44.37 v56.16,44.4 51.18,44.4 50.75,44.83 50.75,55.29 50.49,55.55 v48.5,55.55
SDA  (via drill 0.38)
  Top 0.203: U3.3 v56.71,43.42 55.01,43.42 | 55.01,43.42 49.46,43.42 49.02,43.86 49.02,56.17 48.54,56.65 48.54,56.87 48.27,57.13 U1.11 | R5.1 54.56,43.88 55.01,43.42 | U4.3 60.46,39.4 60.78,39.72 v60.78,39.85
  Bottom 0.203: v60.78,39.85 60.78,40.56 60.5,40.84 57.02,40.84 56.69,41.17 56.69,43.4 v56.71,43.42
SW0_VCC  (via drill 0.38)
  Top 0.203: C17.2 C18.2 | C18.2 60.98,43.71 60.68,43.4 59.79,43.4 U3.6 | U3.8 60.36,42.12 60.63,41.86 C17.2 | C18.2 61.9,47.82 61.49,48.23 56.17,48.23 R4.2 54.7,48.22 54.63,48.28 54.59,48.28 R5.2 52.13,48.24 v52.09,48.28 | U1.6 43.16,57.13 42.57,56.54 v42.57,54.73 | 61.62,37.36 61.62,35.23 61.49,35.1 C19.2 59.64,36.01 59.33,36.32 56.1,36.32 55.8,36.62 55.8,38.32 56.08,38.6 U4.5 | U4.1 61.17,37.8 61.62,37.36 | C17.2 61.9,37.64 61.62,37.36 | U3.2 52.11,42.77 v52.09,42.8
  Route15 0.203: v42.57,54.73 42.57,48.97 43.3,48.23 52.04,48.23 | 52.04,48.23 v52.09,48.28 | v52.09,42.8 51.69,43.2 51.69,47.88 52.04,48.23
SW1_GND  (via drill 0.38)
  Top 0.203: U3.1 58.74,42.12 | 58.74,42.12 58.87,42.26 58.87,42.67 | U3.7 58.98,42.77 58.87,42.67 | U3.5 59.71,44.07 | 59.71,44.07 59.09,44.07 58.87,43.86 58.87,42.67 | C17.1 C18.1 63.42,45.21 v62.99,45.64 | U4.2 U4.DIEPAD | U4.DIEPAD 57.79,39.4 U4.4 55.41,39.4 | U4.DIEPAD 58.59,41.98 58.74,42.12 | U1.7 43.6,56.73 43.33,56.46 43.33,54.4 v43.63,54.1 | 55.41,39.4 v55.39,39.42 | C19.1 55.9,35.1 55.37,35.63 55.37,39.37 55.41,39.4 | v59.76,45.34 59.76,44.13 59.71,44.07
  Route2 0.203: v43.63,54.1 43.63,39.98 44.22,39.39 55.37,39.39 v55.39,39.42 | v62.99,45.64 60.07,45.64 v59.76,45.34
TX
  Top 0.203: U1.9 45.99,53.61 45.06,52.68 18.64,52.68 18.41,52.9 18.41,63.52 18.84,63.95 20.9,63.95 J1.2
V_BATT
  Top 0.254: 24.71,44.84 U2.2 27.85,44.84 28.37,44.32 30.73,44.32 31.03,44.01 31.03,43.05 31.19,42.89 U2.16 | 24.71,44.84 23.83,44.84 23.39,45.28 23.39,47.11 C15.+ | U2.1 25.36,45.49 24.71,44.84
  Top 0.406: BT2.PWR@1 3.32,31.24 1.77,32.79 1.77,42.9 5.76,46.88 16.68,46.88 17.7,47.9 17.7,51.58 18.16,52.04 25.45,52.04 25.93,51.56 25.93,47.82 25.24,47.14 C15.+
VCC  (via drill 0.38)
  Top 0.254: U2.3 22.12,44.19 v21.73,44.59 21.41,44.9 21.41,47.06 C16.+ | U1.17 45.99,60.05 45.82,60.22 45.82,60.98 C7.1 47.34,61.01 C8.1 47.39,60.37 47.06,60.04 v46.94,60.04 | R1.2 58.24,60.79 58.24,62.25 v58.39,62.4
  Route15 0.254: v21.73,44.59 21.61,44.47 20.34,44.47 | v46.94,60.04 46.1,60.04 | v58.39,62.4 58.54,62.25 59.71,62.25
  pour Route15 (rank 2): 13.99,12.72 13.99,64.79 63.52,64.79 63.52,12.72
VCC_1
  Top 0.254: U2.13 32.2,40.92 27.66,40.92 | 27.66,40.92 26.52,40.92 U2.8 C13.1 24.13,40.92 24.13,40.03 24.51,39.64 U2.10 | U2.6 27.47,42.24 27.68,42.03 27.68,40.94 27.66,40.92
VIN  (via drill 0.38)
  Top 0.203: C11.+ C10.+
  Top 0.406: v44.78,46.91 42.85,46.91 C9.+ C10.+ 38.58,46.88 38.5,46.81 35.4,46.81 34.77,46.17 C12.2 | R2.2 34.73,44.05 C12.2 | C12.2 33.78,44.09 33.68,44.19 U2.18
  Bottom 0.406: CELL1.+ 46.98,46.91 v44.78,46.91
XIN
  Top 0.203: U1.2 41.84,58.73 41.25,58.14 41.25,57.55 40.92,57.22 Y1.1
  Top 0.254: C3.1 Y1.1
XOUT
  Top 0.203: U1.1 41.56,59.13 40.97,58.54 37.94,58.54 37.79,58.7 37.79,59.48 37.88,59.57
  Top 0.254: Y1.3 37.88,59.57 C4.1

### Text on the board
tNames: Garden Stake
bNames: Garden Stake